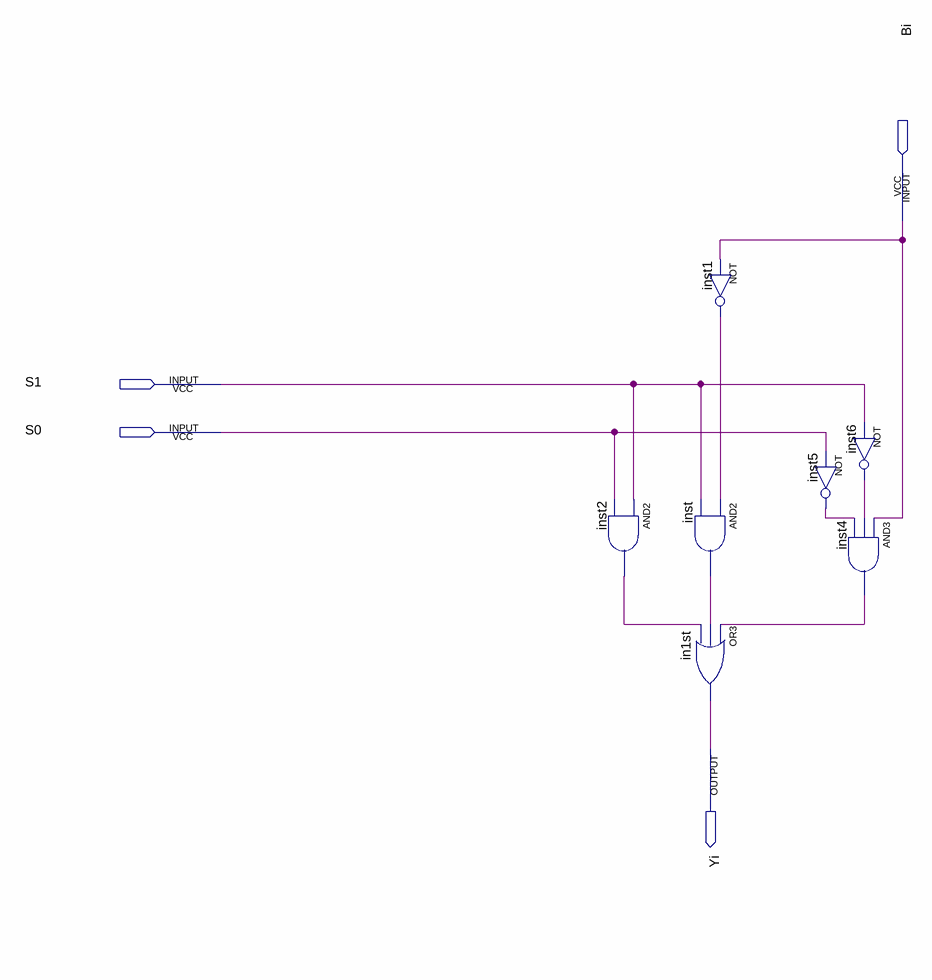
[diagram p0: schematic sheet]
// Quartus schematic AE.bdf as structural Verilog: 7 symbols, 4 pins
module AE (
  input  Bi,
  input  S1,
  input  S0,
  output Yi
);

  wire inst1_out, inst2_out, inst4_out, inst5_out, inst6_out, inst_out;

  and inst2 (inst2_out, S1, S0);
  not inst1 (inst1_out, Bi);
  and inst (inst_out, inst1_out, S1);
  or in1st (Yi, inst4_out, inst_out, inst2_out);
  not inst6 (inst6_out, S1);
  not inst5 (inst5_out, S0);
  and inst4 (inst4_out, Bi, inst6_out, inst5_out);
endmodule
